# EAGLE design dash_power_supply (EAGLE 7.7.0)
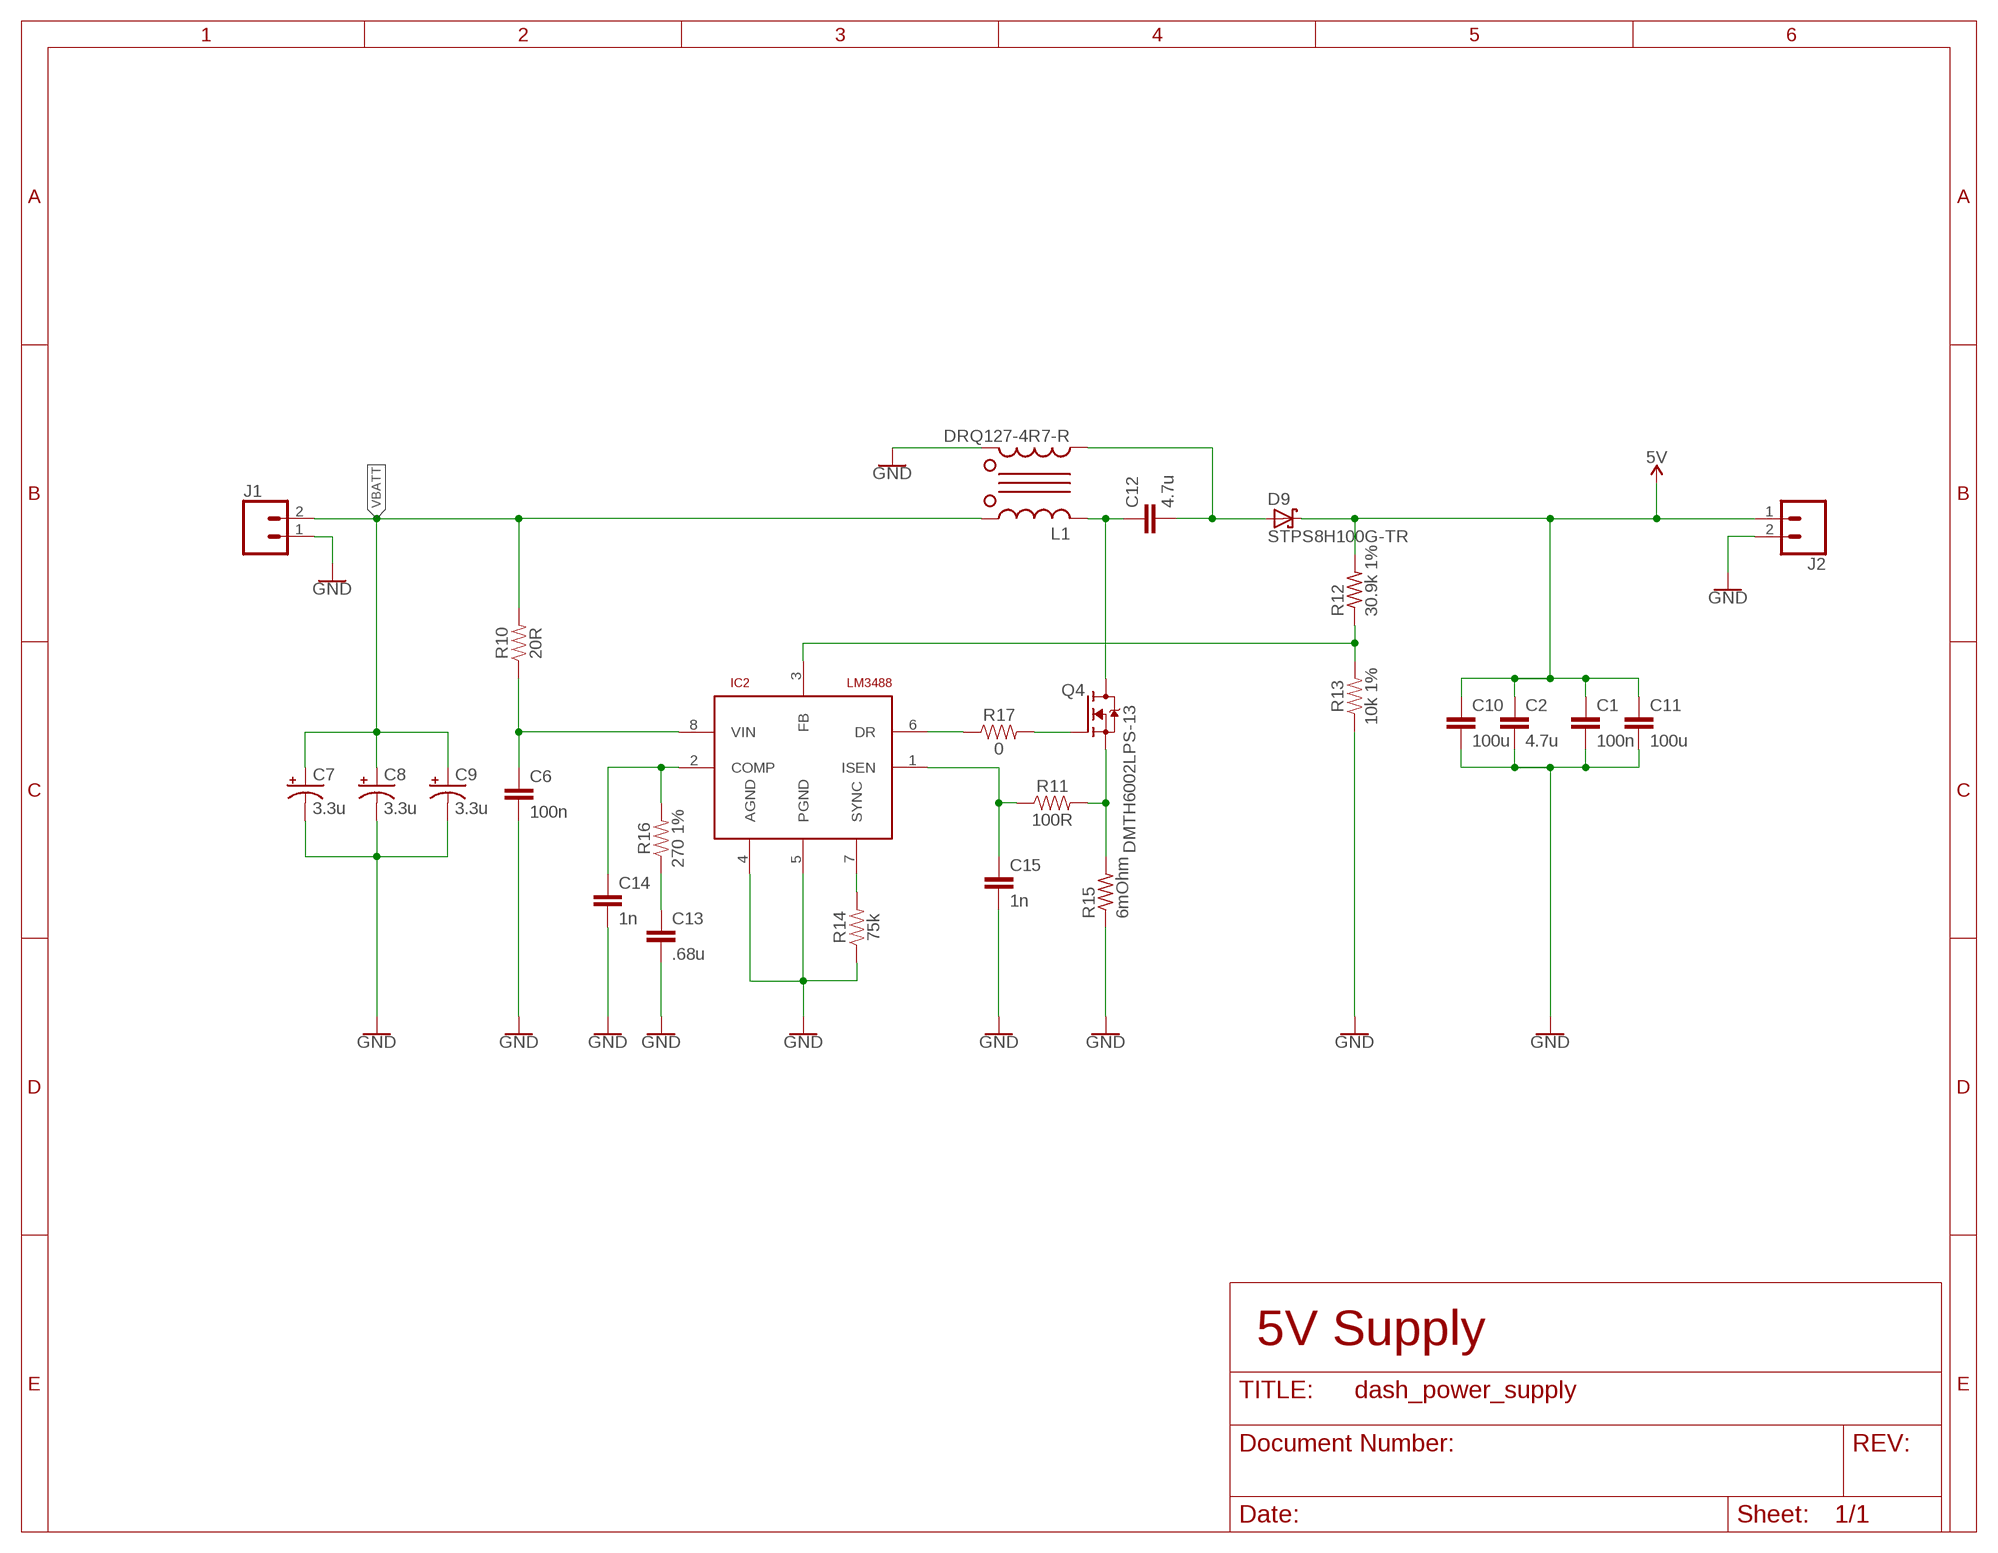
[diagram p0: schematic, sheet 1]

## Parts
C1  100n  CL10B104MB8NNNC  [0603]
C2  4.7u  CL10A475KL8NRNC  [0603]
C6  100n  CL10B104MB8NNNC  [0603]
C7  3.3u  EEV-FK1K3R3R  [PANASONIC_C]
C8  3.3u  EEV-FK1K3R3R  [PANASONIC_C]
C9  3.3u  EEV-FK1K3R3R  [PANASONIC_C]
C10  100u  CL32A107MPVNNNE  [C1210]
C11  100u  CL32A107MPVNNNE  [C1210]
C12  4.7u  CL10A475KL8NRNC  [0603]
C13  .68u  CL10B684KO8NFNC  [0603]
C14  1n  CL10B102KB8NNWC  [0603]
C15  1n  CL10B102KB8NNWC  [0603]
D9  STPS8H100G-TR  [TO263]
IC2  LM3488  [VSSOP-8]
J1  CONN_02PTH4  [1X02_XTRA_BIG]
J2  CONN_02PTH4  [1X02_XTRA_BIG]
L1  DRQ127-4R7-R  [DRQ127]
Q4  DMTH6002LPS-13  [TDSON]
R10  20R  RC0603JR-0720RL  [0603]
R11  100R  RC0603JR-07100RL  [0603]
R12  30.9k 1%  RC1206FR-0730K9L  [R1206]
R13  10k 1%  RC0603FR-1010KL  [0603]
R14  75k  75KOHM-0603-1/10W-1%  [0603]
R15  6mOhm  PRL1632-R006-F-T1  [3216]
R16  270 1%  RC0603FR-07270RL  [0603]
R17  0  0OHM-0603-1/10W  [0603]

## Nets
5V: C1.1 C2.1 C10.1 C11.1 D9.3(C) J2.1 R12.2
GND: C1.2 C2.2 C6.2 C7.- C8.- C9.- C10.2 C11.2 C13.2 C14.2 C15.2 IC2.4(AGND) IC2.5(PGND) J1.1 J2.2 L1.2 R13.1 R14.1 R15.1
N$11: Q4.4(G) R17.2
N$12: C6.1 IC2.8(VIN) R10.1
N$13: IC2.3(FB) R12.1 R13.2
N$15: IC2.6(DR) R17.1
N$16: C15.1 IC2.1(ISEN) R11.1
N$17: Q4.1(S) Q4.2(S) Q4.3(S) R11.2 R15.2
N$18: C12.1 L1.3 Q4.5(D)
N$19: C12.2 D9.2(A) L1.4
N$20: C14.1 IC2.2(COMP) R16.2
N$21: C13.1 R16.1
N$22: IC2.7(SYNC) R14.2
VBATT: C7.+ C8.+ C9.+ J1.2 L1.1 R10.2

## Notes on the sheet
- 5V Supply

## Library data of the parts
C1 C6 C14 C15 = digital_dash:CL; VOLTAGE: 50V
C2 C12 = digital_dash:CL; VOLTAGE: 35V
C7-C9 = dash_power_supply:EEV-FK; VOLTAGE: 80v
C10 C11 = dash_power_supply:CL32; VOLTAGE: 10V
C13 = digital_dash:CL; VOLTAGE: 16V
D9 = dash_power_supply:STPS8H100G-TR
IC2 = dash_power_supply:LM3488
J1 J2 = SparkFun-Connectors:CONN_02: Multi connection point. Often used as Generic Header-pin footprint for 0.1 inch spaced/style header connections On any of the 0.1 inch spaced packages, you can populate with these: Break Away Headers - Straight <https://www.sparkfun.com/products/116> (PRT-00116) Break Away Male Headers - Right Angle <https://www.sparkfun.com/products/553> (PRT-00553) Female Headers <https://www.sparkfun.com/products/115> (PRT-00115) Break Away Headers - Machine Pin <https://www.sparkfun.com/products/117> (PRT-00117) Break Away Female Headers - Swiss Machine Pin <https://www.sparkfun.com/products/743> (PRT-00743) For SCREWTERMINALS and SPRING TERMINALS visit here: Screw Terimnals on SparkFun.com <https://www.sparkfun.com/search/results?term=Screw+Terminals> (5mm/3.5mm/2.54mm spacing) This device is also useful as a general connection point to wire up your design to another part of your project. Our various solder wires solder well into these plated through hole pads. Hook-Up Wire - Assortment (Stranded, 22 AWG) <https://www.sparkfun.com/products/11375> (PRT-11375) Hook-Up Wire - Assortment (Solid Core, 22 AWG) <https://www.sparkfun.com/products/11367> (PRT-11367) View the entire wire category on our website here <https://www.sparkfun.com/categories/141> Special notes: Molex polarized connector foot print use with: PRT-08233 with associated crimp pins and housings. 2.54_SCREWTERM for use with PRT-10571. 3.5mm Screw Terminal footprints for PRT-08084 5mm Screw Terminal footprints for use with PRT-08432
L1 = dash_power_supply:DRQ127
Q4 = dash_power_supply:DMTH6002LPS-13
R10 R11 = digital_dash:RC0603JR
R12 = dash_power_supply:RC1206FR; POWER: .25W
R13 R16 = digital_dash:RC0603FR
R14 = SparkFun-Resistors:75KOHM: 75kΩ resistor A resistor is a passive two-terminal electrical component that implements electrical resistance as a circuit element. Resistors act to reduce current flow, and, at the same time, act to lower voltage levels within circuits. - Wikipedia; PROD_ID: RES-09737
R15 = dash_power_supply:PRL1632; POWER: 1W
R17 = SparkFun-Resistors:0OHM: 0Ω resistor A resistor is a passive two-terminal electrical component that implements electrical resistance as a circuit element. Resistors act to reduce current flow, and, at the same time, act to lower voltage levels within circuits. - Wikipedia; PROD_ID: RES-08609

## Board
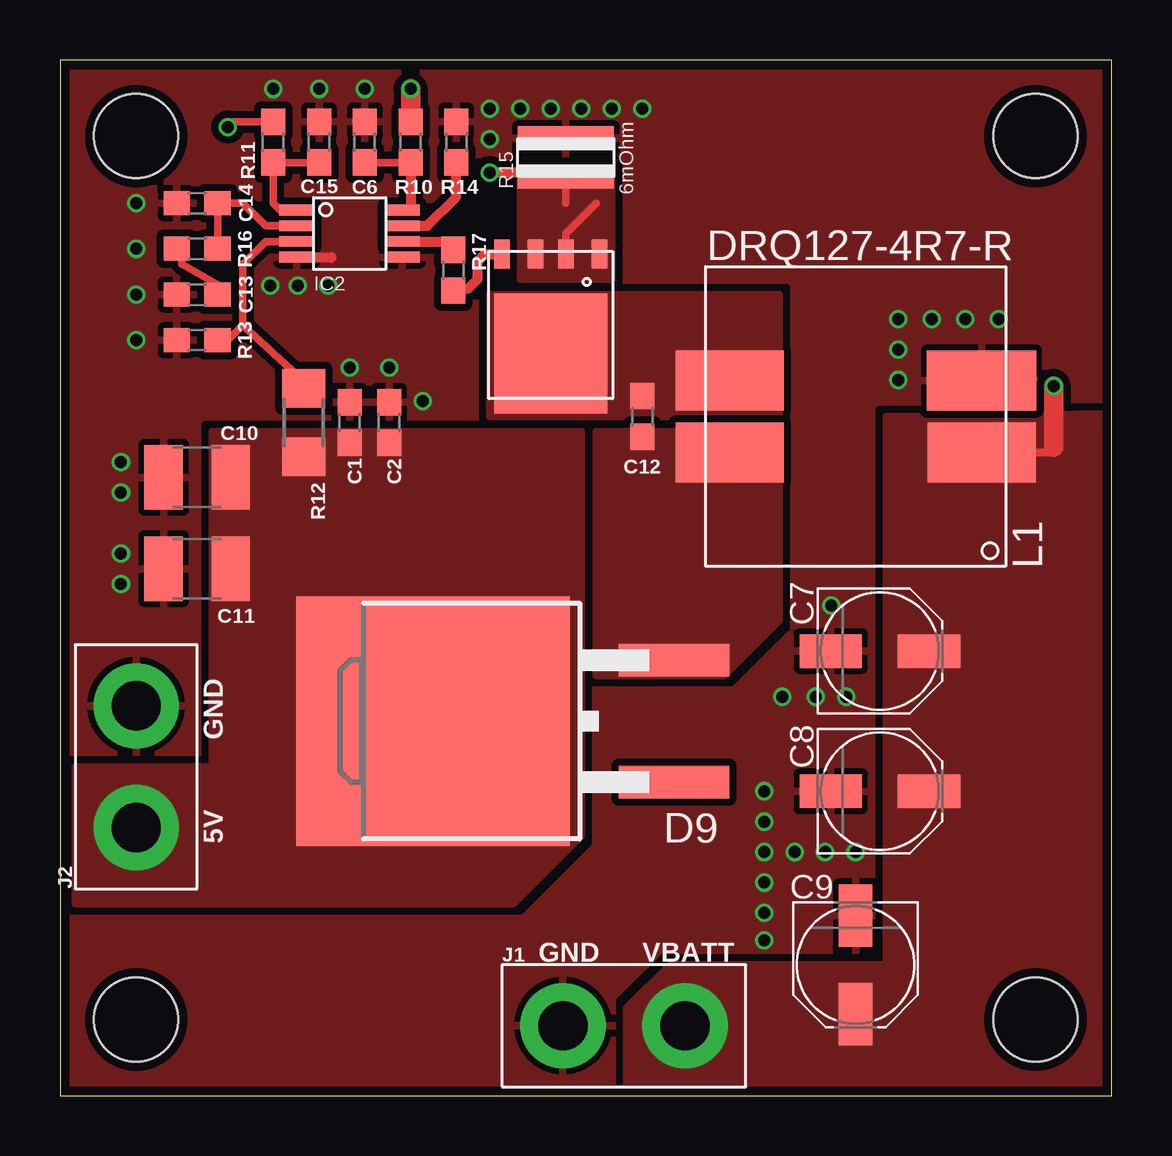
[diagram p1: board, top side]
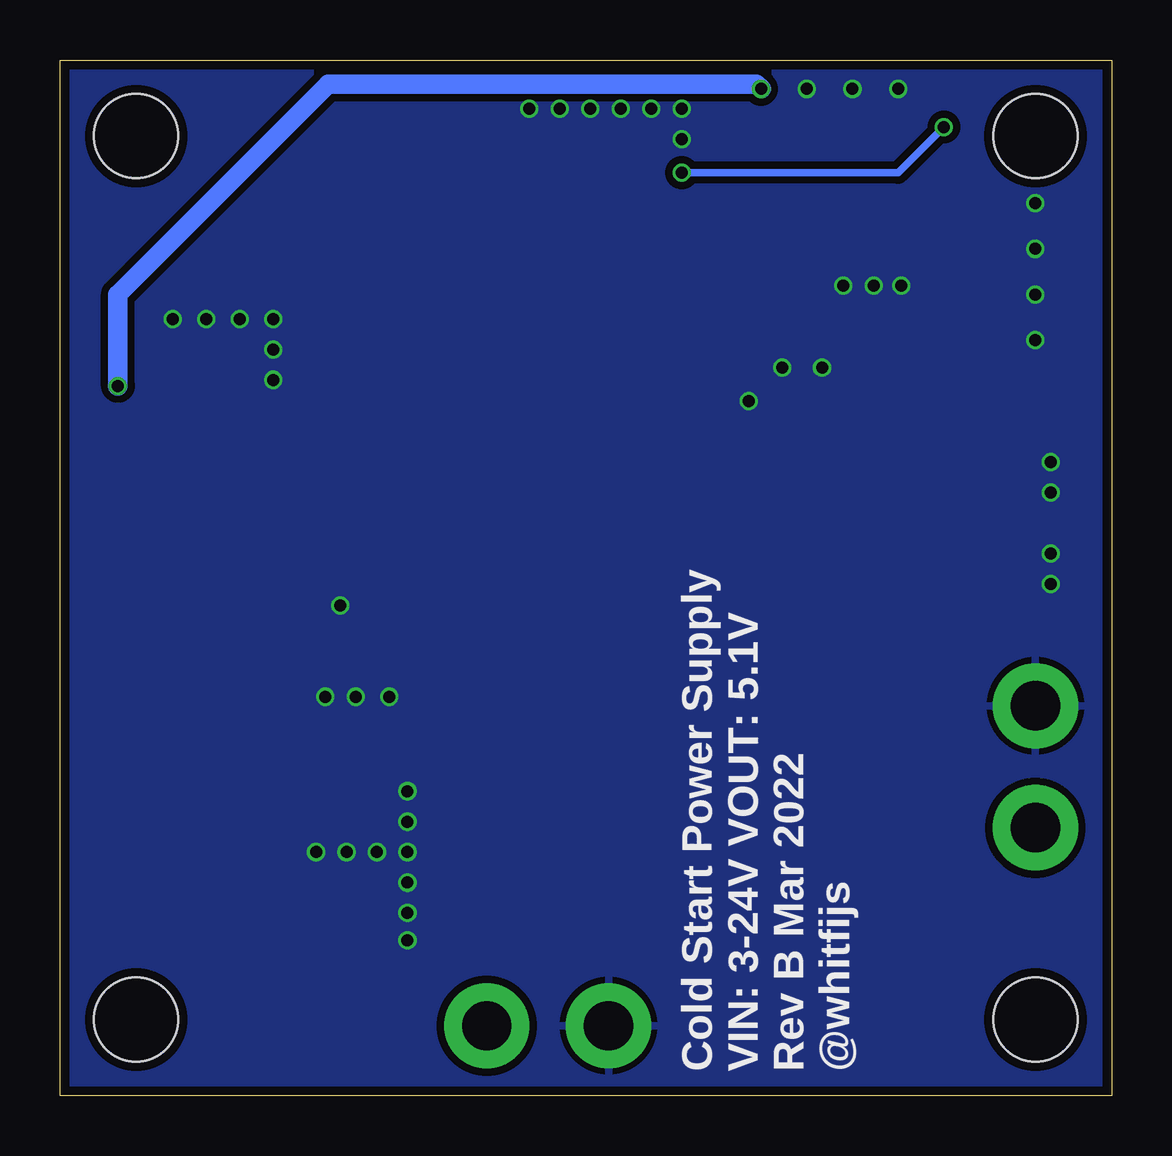
[diagram p2: board, bottom side, seen from below]

Size 43.81 x 43.18 mm. Coordinates in mm from the lower left corner, seen from the top.
Outline: 0,0 43.81,0 43.81,43.18 0,43.18 0,0
Copper layers (1*16): Top 0.035559375mm / dielectric 1.6mm / Bottom 0.035559375mm
Design rules "oshpark-2layer": minimum track width 6mil, minimum drill 10mil, track to track 6mil, track to pad 6mil, pad to pad 6mil, via to via 6mil, smd to smd 6mil, copper to edge 15mil, drill to drill 6mil, minimum pad ring 5mil, minimum via ring 5mil, stop-mask expansion 2.5mil, vias tented up to drill 0mil, thermal gap 10mil
Holes 3.5 mm at 40.64,40.01 3.17,3.17 3.17,40.01 40.64,3.17

### Footprints (pad centres in the part's own frame; a part is rotated, then mirrored left to right if it is on the bottom)
0603 = smd 1.1 x 1: 1 -0.85,0; 2 0.85,0
PANASONIC_C = smd 2.6 x 1.4: + 2.05,0; - -2.05,0
C1210 = smd 1.6 x 2.7: 1 -1.4,0; 2 1.4,0
TO263 = smd 1.35 x 4.6: 1 -2.54,-5.775; 2 2.54,-5.775 | smd 10.4 x 11.4: 3 0,4.275
VSSOP-8 = smd 1.45 x 0.45: 1 -2.2,0.975; 2 -2.2,0.325; 3 -2.2,-0.325; 4 -2.2,-0.975; 5 2.2,-0.975; 6 2.2,-0.325; 7 2.2,0.325; 8 2.2,0.975
1X02_XTRA_BIG = drill 2.057 pad 3.556: 1 -2.54,0; 2 2.54,0
DRQ127 = smd 4.5 x 2.5: 1 -5.25,1.5; 3 5.25,-1.5; 4 5.25,1.5 | smd 4.55 x 2.5: 2 -5.25,-1.5
TDSON = smd 1.2 x 0.65: 1 -2.95,2.025; 2 -2.95,0.635; 3 -2.95,-0.635; 4 -2.95,-2.025 | smd 5 x 4.7: 5 1.2,0
R1206 = smd 1.6 x 1.803: 1 -1.422,0; 2 1.422,0
3216 = smd 1 x 4: 1 -0.8,0; 2 0.8,0

### Placement (x,y rotation side)
C1  12.06,28.07 90 top
C2  13.72,28.07 90 top
C6  12.7,39.75 90 top
C7  34.16,18.54 0 top
C8  34.16,12.7 0 top
C9  33.15,5.46 270 top
C10  5.71,25.78 180 top
C11  5.71,21.97 180 top
C12  24.26,28.32 270 top
C13  5.71,33.4 180 top
C14  5.71,37.21 180 top
C15  10.79,39.75 90 top
D9  19.81,15.62 90 top
IC2  12.06,35.94 0 top
J1  23.5,2.92 0 top
J2  3.17,13.72 90 top
L1  33.15,28.32 180 top
Q4  20.45,32.13 270 top
R10  14.61,39.75 90 top
R11  8.89,39.75 90 top
R12  10.16,28.07 270 top
R13  5.71,31.5 0 top
R14  16.51,39.75 270 top
R15  21.08,39.12 270 top
R16  5.71,35.31 0 top
R17  16.38,34.42 270 top

### Tracks (layer width: path | path; a pad name or v marks a point on that pad's centre or on a via)
5V
  pour Top (isolate 0.305, no thermals): 21.72,27.69 21.72,10.84 18.88,8 0.64,8 0.64,13.72 6.35,13.72 6.35,27.69
GND  (via drill 0.5)
  Top 0.406: IC2.4 11.3,34.97 11.3,34.92
  other vias: 29.34,7.62 29.34,8.89 29.34,10.16 29.34,11.43 32.77,16.64 30.61,10.16 33.15,10.16 30.1,16.64 32.13,20.45 31.5,16.64 39.12,32.38 37.72,32.38 36.32,32.38 17.91,39.88 17.91,41.15 24.26,41.15 20.45,41.15 22.99,41.15 19.18,41.15 21.72,41.15 8.89,41.97 3.17,37.21 3.17,35.31 3.17,33.4 3.17,31.5 2.54,26.42 2.54,25.15 2.54,22.61 2.54,21.34 10.79,41.97 12.7,41.97 31.88,10.16 29.34,6.48 9.91,33.78 8.76,33.78 11.18,33.78 12.06,30.35 13.72,30.35 15.11,28.96 29.34,12.7 34.92,29.84 34.92,31.11 34.92,32.38
  pour Top (isolate 0.305, rank 4): 0,43.05 43.81,43.05 43.81,0 0,0
  pour Bottom (isolate 0.305, rank 4): 0,43.05 0,0 43.81,0 43.81,43.05
N$11
  Top 0.406: R17.2 16.47,33.66 17.02,33.66 17.4,34.04 17.4,34.8 17.68,35.08 Q4.4
N$12
  Top 0.305: 14.73,36.92 14.61,36.92 IC2.8 | R10.1 C6.1
  Top 0.406: R10.1 14.61,36.92
N$13
  Top 0.305: IC2.3 8.56,35.62 7.62,34.67 7.62,32.13 | 7.62,32.13 6.99,31.5 R13.2 | 7.62,32.13 9.68,30.23 R12.1
N$15
  Top 0.406: IC2.6 16.03,35.62 R17.1
N$16
  Top 0.305: IC2.1 9.19,36.92 8.89,37.21 R11.1 C15.1
N$17  (via drill 0.5)
  Top 0.305: 22.35,37.21 21.08,35.94 Q4.2 | 21.08,37.21 R15.2 | v6.99,40.39 7.2,40.6 R11.2
  Top 0.406: R15.2 20.92,38.48 v17.91,38.48
  Bottom 0.305: v6.99,40.39 8.89,38.48 v17.91,38.48
  pour Top (isolate 0.305, no thermals): 19.18,34.04 19.18,38.48 22.99,38.48 22.99,34.04
N$18
  pour Top (isolate 0.305, no thermals): 29.97,28.32 17.91,28.32 17.91,33.4 29.97,33.4
N$19
  pour Top (isolate 0.305, rank 2, no thermals): 29.97,27.69 22.35,27.69 22.35,17.53 27.68,17.53 29.97,19.82
N$20
  Top 0.305: IC2.2 8.56,36.27 7.62,37.21 C14.1 R16.2
N$21
  Top 0.305: R16.1 5.08,35.09 5.08,34.67 6.57,33.82 C13.1
N$22
  Top 0.406: IC2.7 15.31,36.27 16.51,37.47 R14.2
VBATT  (via drill 0.5)
  Top 0.305: L1.1 41.17,26.82 41.4,27.05
  Top 0.813: v41.4,29.59 41.4,27.05 | v14.61,41.97 R10.2
  Bottom 0.813: v41.4,29.59 41.4,33.4 32.64,42.16 14.8,42.16 v14.61,41.97
  pour Top (isolate 0.305, no thermals): 23.62,0.13 43.81,0.25 43.81,28.45 34.42,28.32 34.42,5.46 25.42,5.46 23.62,3.66

### Text on the board
tPlace: GND | 5V | GND | VBATT
bPlace: Cold Start Power Supply / VIN: 3-24V VOUT: 5.1V / Rev B Mar 2022 / @whitfijs